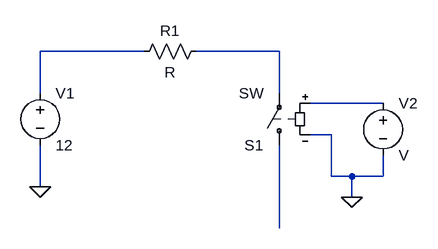
[diagram p0: schematic Draft1.asc]
Draft1.asc, the LTspice schematic file:
Version 4.1
SHEET 1 880 680
WIRE 144 32 -16 32
WIRE 352 32 224 32
WIRE -16 96 -16 32
WIRE 352 96 352 32
WIRE 512 112 400 112
WIRE 432 160 400 160
WIRE 432 224 432 160
WIRE 464 224 432 224
WIRE 512 224 512 192
WIRE 512 224 464 224
WIRE -16 240 -16 176
WIRE 464 256 464 224
WIRE 352 304 352 176
FLAG -16 240 0
FLAG 464 256 0
SYMBOL voltage -16 80 R0
WINDOW 123 0 0 Left 0
WINDOW 39 0 0 Left 0
SYMATTR InstName V1
SYMATTR Value 12
SYMBOL res 240 16 R90
WINDOW 0 0 56 VBottom 2
WINDOW 3 32 56 VTop 2
SYMATTR InstName R1
SYMBOL sw 352 192 R180
SYMATTR InstName S1
SYMBOL voltage 512 96 R0
SYMATTR InstName V2

The netlist it stands for:
* Draft1.asc
V1 N001 0 12
R1 N002 N001 R
S1 N004 N002 N003 0 SW
V2 N003 0 V
.backanno
.end